# Altium schematic sheet Function Board V0.3.SchDoc
size A4; SheetNumber: 3; SheetTotal: 5
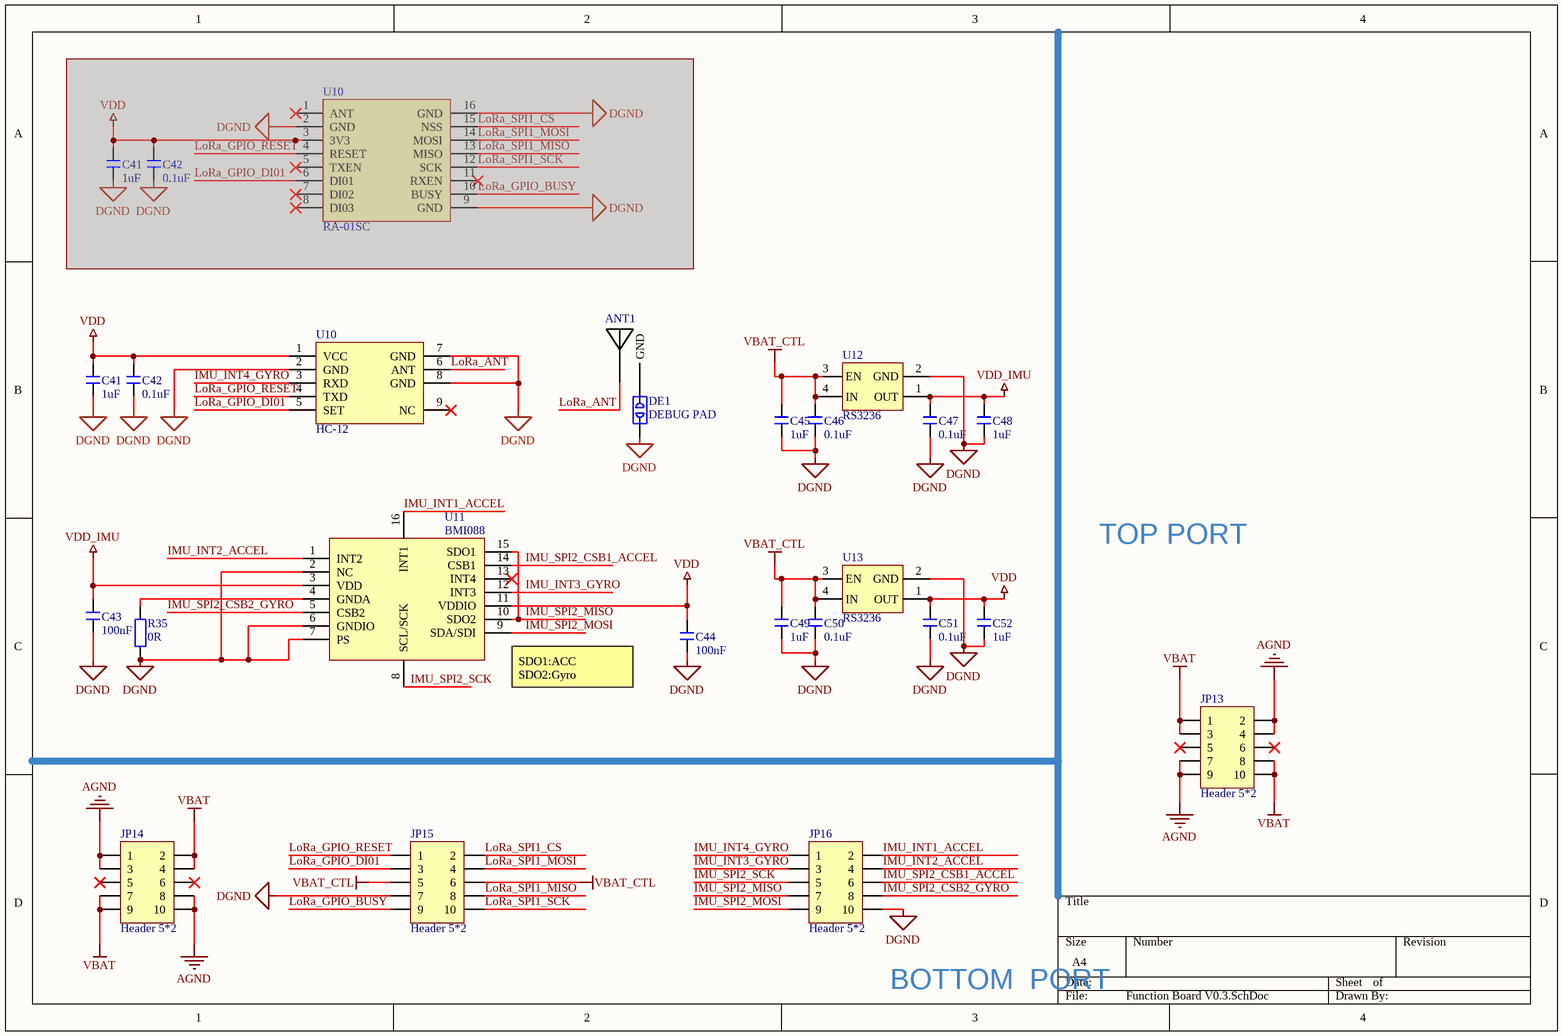
[diagram p0: Function Board V0.3.SchDoc]

## Parts
(Parts that share a designator on the sheet are numbered #1, #2 ... from top to bottom, then left to right.)
ANT1  FTP_ANT  [FTP ANT]  (value not drawn)
C41#1  1uF  [C 0603_L]  (masked out: inside a compile mask, not in the netlist)
C41#2  1uF  [C 0603_L]
C42#1  0.1uF  [C 0603_L]  (masked out: inside a compile mask, not in the netlist)
C42#2  0.1uF  [C 0603_L]
C43  100nF  [C 0603_L]
C44  100nF  [C 0603_L]
C45  1uF  [C 0603_L]
C46  0.1uF  [C 0603_L]
C47  0.1uF  [C 0603_L]
C48  1uF  [C 0603_L]
C49  1uF  [C 0603_L]
C50  0.1uF  [C 0603_L]
C51  0.1uF  [C 0603_L]
C52  1uF  [C 0603_L]
DE1  DEBUG PAD  [DEBUG_B]
JP13  Header 5*2  [BTB-0.8mm-SMD-F-2*5PIN]
JP14  Header 5*2  [BTB-0.8mm-SMD-F-2*5PIN]
JP15  Header 5*2  [BTB-0.8mm-SMD-F-2*5PIN]
JP16  Header 5*2  [BTB-0.8mm-SMD-F-2*5PIN]
R35  0R  [R 0603_L]
U10#1  RA-01SC  [RA-01S-SMT]  (masked out: inside a compile mask, not in the netlist)
U10#2  HC-12  [HC-12]
U11  BMI088  [LGA-16_L4.5-W3.0-P0.50-BL]
U12  RS3236  [UTDFN1x1-4]
U13  RS3236  [UTDFN1x1-4]

## Nets
AGND: JP13.2 JP13.4 JP13.7 JP13.9 JP14.1 JP14.3 JP14.8 JP14.10
DGND: C41#2.1 C42#2.2 C43.1 C44.1 C45.1 C46.2 C47.2 C48.1 C49.1 C50.2 C51.2 C52.1 DE1.1 JP15.7 JP16.10 R35.1 U10#2.2(GND) U10#2.7(GND) U10#2.8(GND) U11.2(NC) U11.6(GNDIO) U11.7(PS) U12.2(GND) U13.2(GND)
VBAT: JP13.1 JP13.3 JP13.8 JP13.10 JP14.2 JP14.4 JP14.7 JP14.9
VBAT_CTL: C45.2 C46.1 C49.2 C50.1 JP15.5 JP15.6 U12.3(EN) U12.4(IN) U13.3(EN) U13.4(IN)
VDD: C41#2.2 C42#2.1 C44.2 C51.1 C52.2 U10#2.1(VCC) U11.11(VDDIO) U13.1(OUT)
VDD_IMU: C43.2 C47.1 C48.2 U11.3(VDD) U12.1(OUT)
IMU_INT1_ACCEL: JP16.2 U11.16(INT1)
IMU_INT2_ACCEL: JP16.4 U11.1(INT2)
IMU_INT3_GYRO: JP16.3 U11.12(INT3)
IMU_INT4_GYRO: JP16.1 U10#2.3(RXD)
IMU_SPI2_CSB1_ACCEL: JP16.6 U11.14(CSB1)
IMU_SPI2_CSB2_GYRO: JP16.8 U11.5(CSB2)
IMU_SPI2_MISO: JP16.7 U11.10(SDO2) U11.15(SDO1)
IMU_SPI2_MOSI: JP16.9 U11.9(SDA/SDI)
IMU_SPI2_SCK: JP16.5 U11.8(SCL/SCK)
LoRa_ANT: ANT1.1 U10#2.6(ANT)
LoRa_GPIO_BUSY: JP15.9
LoRa_GPIO_DI01: JP15.3 U10#2.5(SET)
LoRa_GPIO_RESET: JP15.1 U10#2.4(TXD)
LoRa_SPI1_CS: JP15.2
LoRa_SPI1_MISO: JP15.8
LoRa_SPI1_MOSI: JP15.4
LoRa_SPI1_SCK: JP15.10
NetANT1_2: ANT1.2(GND) DE1.2
NetR35_2: R35.2 U11.4(GNDA)

Not connected (* = marked no-connect by the designer): JP13 5* 6*; JP14 5* 6*; U10#2 9(NC)*; U11 13(INT4)*

## Notes on the sheet
- TOP PORT
- (near U11) SDO1:ACC
  SDO2:Gyro
- BOTTOM  PORT

## Library data of the parts
ANT1 = FTP_ANT: 陶瓷天线; BOM名称: PCB板载天线; 版权归属: 封装库来自淘宝 ID：黄晶宝石; 学习资源: https://shop463601444.taobao.com
C41#1 C41#2 C42#1 C42#2 C43-C52 = C: 贴片电容; BOM名称: 无极性贴片电容; 淘宝ID: 封装库来自淘宝 ID：黄晶宝石; 联系售后: https://shop463601444.taobao.com
DE1 = DEBUG: 调试断点焊盘; 版权归属: 封装库来自淘宝 ID：黄晶宝石; BOM名称: 调试断点焊盘; 学习资源: https://shop463601444.taobao.com
JP13-JP16 = Header 5*2: BTB Connector
R35 = R: 贴片电阻; 版权归属: 来自淘宝 ID：黄晶宝石; BOM名称: 贴片电阻; 联系售后: https://shop463601444.taobao.com
U10#1 = RA-01SC: 安信可LoRa; BOM名称: MP3模块; 版权归属: 封装库来自淘宝 ID：黄晶宝石; 学习资源: https://shop463601444.taobao.com
U10#2 = HC-12: 433MHz无线串口模块
U11 = BMI088: 6-axis Motion Tracking for High-performance Applications
U12 U13 = RS3236: 500mA LDO